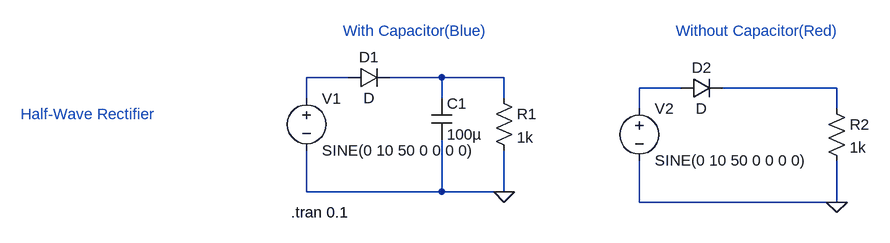
[diagram p0: schematic Half-WaveRectifier.asc]
Half-WaveRectifier.asc, the LTspice schematic file:
Version 4.1
SHEET 1 936 680
WIRE 96 112 32 112
WIRE 240 112 160 112
WIRE 336 112 240 112
WIRE 608 128 544 128
WIRE 848 128 672 128
WIRE 32 144 32 112
WIRE 240 144 240 112
WIRE 336 144 336 112
WIRE 544 160 544 128
WIRE 848 160 848 128
WIRE 32 288 32 224
WIRE 240 288 240 208
WIRE 240 288 32 288
WIRE 336 288 336 224
WIRE 336 288 240 288
WIRE 544 304 544 240
WIRE 848 304 848 240
WIRE 848 304 544 304
FLAG 336 288 0
FLAG 848 304 0
SYMBOL diode 96 128 R270
WINDOW 0 32 32 VTop 2
WINDOW 3 0 32 VBottom 2
SYMATTR InstName D1
SYMBOL voltage 32 128 R0
WINDOW 123 0 0 Left 0
WINDOW 39 0 0 Left 0
SYMATTR InstName V1
SYMATTR Value SINE(0 10 50 0 0 0 0)
SYMBOL cap 224 144 R0
SYMATTR InstName C1
SYMATTR Value 100µ
SYMBOL res 320 128 R0
SYMATTR InstName R1
SYMATTR Value 1k
SYMBOL diode 608 144 R270
WINDOW 0 32 32 VTop 2
WINDOW 3 0 32 VBottom 2
SYMATTR InstName D2
SYMBOL voltage 544 144 R0
WINDOW 123 0 0 Left 0
WINDOW 39 0 0 Left 0
SYMATTR InstName V2
SYMATTR Value SINE(0 10 50 0 0 0 0)
SYMBOL res 832 144 R0
SYMATTR InstName R2
SYMATTR Value 1k
TEXT 8 320 Left 2 !.tran 0.1
TEXT 88 40 Left 2 ;With Capacitor(Blue)
TEXT 600 40 Left 2 ;Without Capacitor(Red)
TEXT -408 168 Left 2 ;Half-Wave Rectifier

The netlist it stands for:
* Half-WaveRectifier.asc
D1 N001 N002 D
V1 N001 0 SINE(0 10 50 0 0 0 0)
C1 N002 0 100µ
R1 N002 0 1k
D2 N003 N004 D
V2 N003 0 SINE(0 10 50 0 0 0 0)
R2 N004 0 1k
.model D D
.lib standard.dio
.tran 0.1
* With Capacitor(Blue)
* Without Capacitor(Red)
* Half-Wave Rectifier
.backanno
.end